# EAGLE design esp32-gps-eth-v10modules2 (EAGLE 7.3.0)
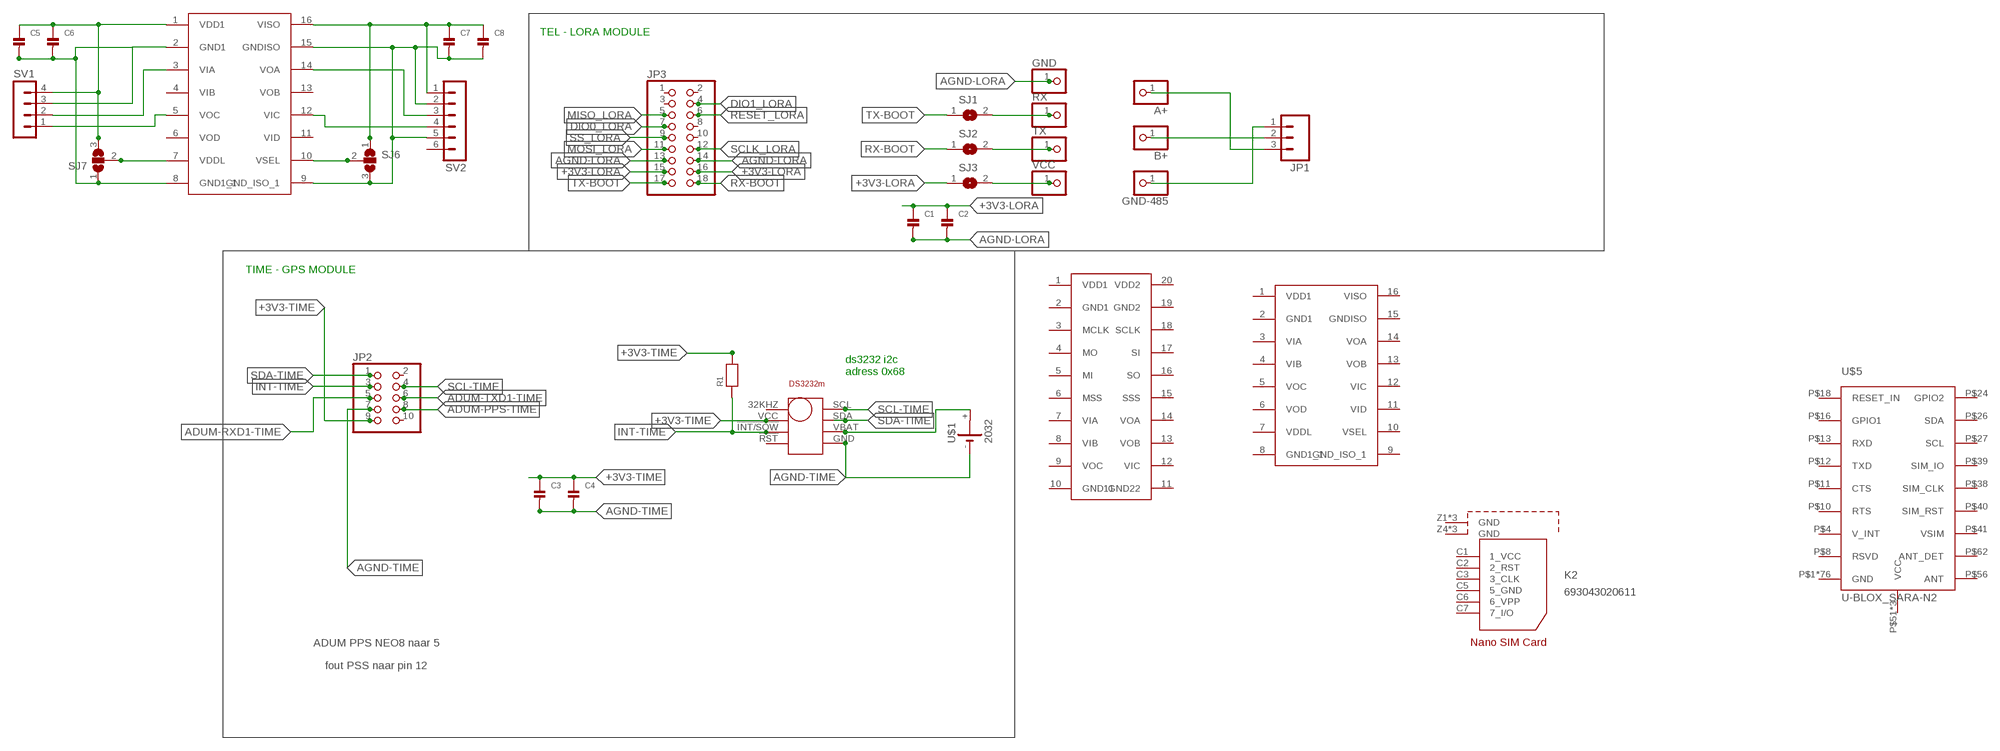
[diagram p0: schematic, sheet 1]

## Parts
A+  PINHD-1X1CB  [1X01-CLEANBIG]
ADUM4151  ADUM4151  [SOIC20R]
B+  PINHD-1X1CB  [1X01-CLEANBIG]
C1  CAP_CERAMIC0805  [0805]
C2  CAP_CERAMIC0805  [0805]
C3  CAP_CERAMIC0805  [0805]
C4  CAP_CERAMIC0805  [0805]
C5  CAP_CERAMIC0805  [0805]
C6  CAP_CERAMIC0805  [0805]
C7  CAP_CERAMIC0805  [0805]
C8  CAP_CERAMIC0805  [0805]
GND  PINHD-1X1CB  [1X01-CLEANBIG]
GND-485  PINHD-1X1CB  [1X01-CLEANBIG]
JP1  M03SCREW  [SCREWTERMINAL-3.5MM-3]
JP2  PINHD-2X5/90  [2X05/90]
JP3  PINHD-2X9/90  [2X09/90]
K2  693043020611  [693043020611]
R1  RESISTOR0805  [0805]
RX  PINHD-1X1CB  [1X01-CLEANBIG]
SJ1  SOLDERJUMPERREFLOW  [SOLDERJUMPER_REFLOW]
SJ2  SOLDERJUMPERREFLOW  [SOLDERJUMPER_REFLOW]
SJ3  SOLDERJUMPERREFLOW  [SOLDERJUMPER_REFLOW]
SJ6  SJ2W  [SJ_2]
SJ7  SJ2W  [SJ_2]
SV1  MA04-1  [MA04-1]
SV2  MA06-1  [MA06-1]
TX  PINHD-1X1CB  [1X01-CLEANBIG]
U$1  2032  [KZH20SMD]
U$2  ADUM6402  [SOIC16R]
U$3  ADUM6402  [SOIC16R]
U$4  DS3232M  [SOIC8]
U$5  U-BLOX_SARA-N2  [SARA-N2]
VCC  PINHD-1X1CB  [1X01-CLEANBIG]

## Nets
+3V3-LORA: C1.1 C2.1 JP3.15 JP3.16 SJ3.1
+3V3-TIME: C3.1 C4.1 JP2.9 R1.2 U$4.VCC
ADUM-PPS-TIME: JP2.8
ADUM-RXD1-TIME: JP2.5
ADUM-TXD1-TIME: JP2.6
AGND-LORA: C1.2 C2.2 GND.1 JP3.13 JP3.14
AGND-TIME: C3.2 C4.2 JP2.7 U$1.- U$4.GND
DIO0_LORA: JP3.7
DIO1_LORA: JP3.4
GND-PROG1: C5.2 C6.2 SJ7.1 U$3.8(GND1_1)
GND-PROG2: C7.2 C8.2 SJ6.3 SV2.2 SV2.5 U$3.9(GND_ISO_1) U$3.15(GNDISO)
INT-TIME: JP2.3 R1.1 U$4.!INT/!!SQW
MISO_LORA: JP3.5
MOSI_LORA: JP3.11
N$1: A+.1 JP1.3
N$2: B+.1 JP1.2
N$3: GND-485.1 JP1.1
N$4: RX.1 SJ1.2
N$6: U$1.+ U$4.VBAT
N$7: SJ2.2 TX.1
N$8: SJ3.2 VCC.1
N$147: SV1.1 U$3.5(VOC)
N$148: SV1.3 U$3.2(GND1)
N$149: SV1.2 U$3.3(VIA)
N$153: SV2.3 U$3.14(VOA)
N$154: SV2.4 U$3.12(VIC)
N$156: SJ7.2 U$3.7(VDDL)
N$157: SJ6.2 U$3.10(VSEL)
RESET_LORA: JP3.6
RX-BOOT: JP3.18 SJ2.1
SCL-TIME: JP2.4 U$4.SCL
SCLK_LORA: JP3.12
SDA-TIME: JP2.1 U$4.SDA
SS_LORA: JP3.9
TX-BOOT: JP3.17 SJ1.1
VCC2-PROG: C7.1 C8.1 SJ6.1 SV2.1 U$3.16(VISO)
VCC-PROG: C5.1 C6.1 SJ7.3 SV1.4 U$3.1(VDD1)
Unconnected: ADUM4151.1(VDD1) ADUM4151.2(GND1) ADUM4151.3(MCLK) ADUM4151.4(MO) ADUM4151.5(MI) ADUM4151.6(MSS) ADUM4151.7(VIA) ADUM4151.8(VIB) ADUM4151.9(VOC) ADUM4151.10(GND11) ADUM4151.11(GND22) ADUM4151.12(VIC) ADUM4151.13(VOB) ADUM4151.14(VOA) ADUM4151.15(SSS) ADUM4151.16(SO) ADUM4151.17(SI) ADUM4151.18(SCLK) ADUM4151.19(GND2) ADUM4151.20(VDD2) JP2.2 JP2.10 JP3.1 JP3.2 JP3.3 JP3.8 JP3.10 K2.C1(1_VCC) K2.C2(2_RST) K2.C3(3_CLK) K2.C5(5_GND) K2.C6(6_VPP) K2.C7(7_I/O) K2.Z1(GND) K2.Z2(GND) K2.Z3(GND) K2.Z4(GND) K2.Z5(GND) K2.Z6(GND) SV2.6 U$2.1(VDD1) U$2.2(GND1) U$2.3(VIA) U$2.4(VIB) U$2.5(VOC) U$2.6(VOD) U$2.7(VDDL) U$2.8(GND1_1) U$2.9(GND_ISO_1) U$2.10(VSEL) U$2.11(VID) U$2.12(VIC) U$2.13(VOB) U$2.14(VOA) U$2.15(GNDISO) U$2.16(VISO) U$3.4(VIB) U$3.6(VOD) U$3.11(VID) U$3.13(VOB) U$4.32KHZ U$4.!RST U$5.P$4(V_INT) U$5.P$8(RSVD) U$5.P$10(RTS) U$5.P$11(CTS) U$5.P$12(TXD) U$5.P$13(RXD) U$5.P$16(GPIO1) U$5.P$18(RESET_IN) U$5.P$24(GPIO2) U$5.P$26(SDA) U$5.P$27(SCL) U$5.P$38(SIM_CLK) U$5.P$39(SIM_IO) U$5.P$40(SIM_RST) U$5.P$41(VSIM) U$5.P$56(ANT) U$5.P$62(ANT_DET)

## Notes on the sheet
- TEL - LORA MODULE
- TIME - GPS MODULE
- ds3232 i2c
  adress 0x68
- ADUM PPS NEO8 naar 5
- fout PSS naar pin 12

## Power pins joined to a net without a drawn wire
GND: U$5.P$1(GND) U$5.P$2(GND) U$5.P$3(GND) U$5.P$5(GND) U$5.P$6(GND) U$5.P$7(GND) U$5.P$9(GND) U$5.P$14(GND) U$5.P$15(GND) U$5.P$17(GND) U$5.P$19(GND) U$5.P$20(GND) U$5.P$21(GND) U$5.P$22(GND) U$5.P$23(GND) U$5.P$25(GND) U$5.P$28(GND) U$5.P$29(GND) U$5.P$30(GND) U$5.P$31(GND) U$5.P$32(GND) U$5.P$33(GND) U$5.P$34(GND) U$5.P$35(GND) U$5.P$36(GND) U$5.P$37(GND) U$5.P$42(GND) U$5.P$43(GND) U$5.P$44(GND) U$5.P$45(GND) U$5.P$46(GND) U$5.P$47(GND) U$5.P$48(GND) U$5.P$49(GND) U$5.P$50(GND) U$5.P$54(GND) U$5.P$55(GND) U$5.P$57(GND) U$5.P$58(GND) U$5.P$59(GND) U$5.P$60(GND) U$5.P$61(GND) U$5.P$63(GND) U$5.P$64(GND) U$5.P$65(GND) U$5.P$66(GND) U$5.P$67(GND) U$5.P$68(GND) U$5.P$69(GND) U$5.P$70(GND) U$5.P$71(GND) U$5.P$72(GND) U$5.P$73(GND) U$5.P$74(GND) U$5.P$75(GND) U$5.P$76(GND) U$5.P$77(GND) U$5.P$78(GND) U$5.P$79(GND) U$5.P$80(GND) U$5.P$81(GND) U$5.P$82(GND) U$5.P$83(GND) U$5.P$84(GND) U$5.P$85(GND) U$5.P$86(GND) U$5.P$87(GND) U$5.P$88(GND) U$5.P$89(GND) U$5.P$90(GND) U$5.P$91(GND) U$5.P$92(GND) U$5.P$93(GND) U$5.P$94(GND) U$5.P$95(GND) U$5.P$96(GND)
VCC: U$5.P$51(VCC) U$5.P$52(VCC) U$5.P$53(VCC)

## Library data of the parts
A+ B+ GND GND-485 RX TX VCC = adafruit:PINHD-1X1: Pin header 1x1 for 0.1" spacing With round pins
ADUM4151 = Schematics:ADUM4151
C1-C8 = microbuilder:CAP_CERAMIC: Ceramic Capacitors 0402 - 0402 Surface Mount Capacitors 16pF 50V 5% [Digikey: 445-4899-2-ND] 18pF 50V 5% [Digikey: 490-1281-2-ND] 22pF 50V 5% [Digikey: 490-1283-2-ND] 68pF 50V 5% [Digikey: 490-1289-2-ND] 0.1uF 10V 10% [Digikey: 490-1318-2-ND] 1.0uF 6.3V 10% [Digikey: 490-1320-2-ND] 0603 - 0603 Surface Mount Capacitors 16 pF 50V 5% [Digikey: 445-5051-2-ND] 22 pF 50V [Digikey: PCC220ACVTR-ND] 33 pF 50V 5% [Digikey: 490-1415-1-ND] 56pF 50V 5% [Digikey: 490-1421-1-ND] 220pF 50V 5% [Digikey: 445-1285-1-ND] 680 pF 50V 2200 pF 50V 5% C0G [Digikey: 445-1297-1-ND] 5600 pF 100V 5% X7R [Digikey: 478-3711-1-ND] 0.1 µF 25V 10% [Digikey: PCC2277TR-ND] 0.22 µF 16V 10% X7R [Digikey: 445-1318-1-ND] 1.0 µF 25V 10% [Digikey: 445-5146-2-ND] 0603 - RF Specific 3pF 250V +/-0.1pF RF [Digikey: 712-1347-1-ND] 18 pF 250V 5% [Digikey: 478-3505-1-ND or 712-1322-1-ND] 56 pF 250V 5% C0G RF [Digikey: 490-4867-1-ND] 68 pF 250V RF [Digikey: 490-4868-1-ND] 0805 - 0805 Surface Mount Capacitors 220 pF 250V 2% RF Ceramic Capacitor [Digikey: 712-1398-1-ND] 1000 pF 50V 2% NP0 Ceramic Capacitor [Digikey: 478-3760-1-ND] 0.1 µF 25V 10% Ceramic Capacitor [Digikey: PCC1828TR-ND] 1.0 µF 16V 10% Ceramic Capacitor[Digikey: 490-1691-2-ND] 10.0 µF 10V 10% Ceramic Capacitor[Digikey: 709-1228-1-ND] 10.0 uF 16V 10% Ceramic Capacitor [Digikey: 478-5165-2-ND] 47 uF 6.3V 20% Ceramic Capacitor [Digikey: 587-1779-1-ND or 399-5506-1-ND] 1206 - 1206 Surface Mount Capacitors 47uF 10V 20% Ceramic Capacitor [Digikey: 490-5528-1-ND or 399-5508-1-ND or 445-6010-1-ND] 100uF 6.3V -20%, +80% Y5V Ceramic Capacitor (Digikey: 490-4512-1-ND, Mouser: 81-GRM31CF50J107ZE1L)
JP1 = SparkFun:M03: Header 3 Standard 3-pin 0.1" header. Use with straight break away headers (SKU : PRT-00116), right angle break away headers (PRT-00553), swiss pins (PRT-00743), machine pins (PRT-00117), and female headers (PRT-00115). Molex polarized connector foot print use with SKU : PRT-08232 with associated crimp pins and housings.
JP2 = pinhead:PINHD-2X5: PIN HEADER
JP3 = pinhead:PINHD-2X9: PIN HEADER
K2 = Wurth_Elektronik_Electromechanic_Input-Output_Connectors_rev15c:693043020611: WR-CRD_Nano SIM_Push & Pull_SMT Nano SIM Push & Pull Type SMT - 1.20mm Height - T&R with Mylar for Pick & Place Code:Con_I-O_COM_CRD_SIM_Nano_693043020611_693043020611 <http://katalog.we-online.de/media/images/eican/Con_I-O_COM_CRD_SIM_Nano_693043020611_pf2.jpg> Details see: http://katalog.we-online.de/en/em/693_043_020_611/693_043_020_611?m Created 2014-12-22, aslant tao 2014 (C) Würth Elektronik
R1 = microbuilder:RESISTOR: Resistors 0402 - 0402 Surface Mount Package 22 Ohm 1% 1/16W [Digikey: 311-22.0LRTR-ND] 33 Ohm 5% 1/16W 1.0K 5% 1/16W 1.5K 5% 1/16W 2.0K 1% 1/16W 10.0K 1% 1/16W [Digikey: 311-10.0KLRTR-ND] 10.0K 5% 1/16W [Digikey: RMCF0402JT10K0TR-ND] 12.1K 1% 1/16W [Digikey: 311-22.0LRTR-ND] 100.0K 5% 1/16W 0603 - 0603 Surface Mount Package 0 Ohm 1/10 Watt 1% Resistor 15 Ohm 1/10 Watt 1% Resistor 33 Ohm 1/10 Watt 1% Resistor 49.9 Ohm 1/10 Watt 1% Resistor 100 Ohm 1/10 Watt 1% Resistor 150 Ohm 1/10 Watt 1% Resistor 240 Ohm 1/10 Watt 1% Resistor 390 Ohm 1/10 Watt 1% Resistor 560 Ohm 1/10 Watt 1% Resistor 680 Ohm 1/10 Watt 1% Resistor 750 Ohm 1/10 Watt 1% Resistor 1.0K Ohm 1/10 Watt 1% Resistor 1.5K Ohm 1/10 Watt 1% Resistor 2.0K Ohm 1/10 Watt 1% Resistor 2.2K Ohm 1/10 Watt 1% Resistor 3.3K Ohm 1/10 Watt 1% Resistor 4.7K Ohm 1/10 Watt 1% Resistor 10.0K Ohm 1/10 Watt 1% Resistor 12.0K Ohm 1/10 Watt 1% Resistor 12.1K Ohm 1/10 Watt 1% Resistor 20.0K Ohm 1/10 Watt 1% Resistor 33.0K Ohm 1/10 Watt 1% Resistor 100.0K Ohm 1/10 Watt 1% Resistor 0805 - 0805 Surface Mount Package 0 Ohm 1/8 Watt 1% Resistor 33 Ohm 1/8 Watt 1% Resistor 100 Ohm 1/8 Watt 1% Resistor 150 Ohm 1/8 Watt 1% Resistor 200 Ohm 1/8 Watt 1% Resistor 240 Ohm 1/8 Watt 1% Resistor 330 Ohm 1/8 Watt 1% Resistor 390 Ohm 1/8 Watt 1% Resistor 470 Ohm 1/8 Watt 1% Resistor 1.0K Ohm 1/8 Watt 1% Resistor 1.5K Ohm 1/8 Watt 1% Resistor 2.0K Ohm 1/8 Watt 1% Resistor 4.7K Ohm 1/8 Watt 1% Resistor 5.1K Ohm 1/8 Watt 1% Resistor 5.6K Ohm 1/8 Watt 1% Resistor 10.0K Ohm 1/8 Watt 1% Resistor 22.0K Ohm 1/8 Watt 1% Resistor 33.0K Ohm 1/8 Watt 1% Resistor 100K Ohm 1/8 Watt 1% Resistor 1206 - 1206 Surface Mount Package 2012 - 2010 Surface Mount Package 0.11 Ohm 1/2 Watt 1% Resistor - Digikey: RHM.11UCT-ND
SJ1-SJ3 = microbuilder:SOLDERJUMPER: SMD Solder JUMPER Solder the two pads together to create a connection, or remove the solder to break it. REFLOW - Use this footprint for solder paste and reflow ovens. WAVE - Use this footprint for hand-soldering (larger pads). CLOSED - Has a trace between the two pads to ensure it is closed by default. The trace needs to be cut to disable the jumper, and can be closed again by creating a solder bridge between the two pads.
SJ6 SJ7 = jumper:SJ2W: SMD solder JUMPER
SV1 = con-lstb:MA04-1: PIN HEADER; OC_FARNELL: unknown; OC_NEWARK: unknown
SV2 = con-lstb:MA06-1: PIN HEADER; OC_FARNELL: unknown; OC_NEWARK: unknown
U$1 = kzh20_lithium_batterie_holder:2032
U$2 U$3 = ADUM6402:ADUM6402
U$4 = DS3232M:DS3232M
U$5 = UBLOX_SARA-N2:U-BLOX_SARA-N2

## Board
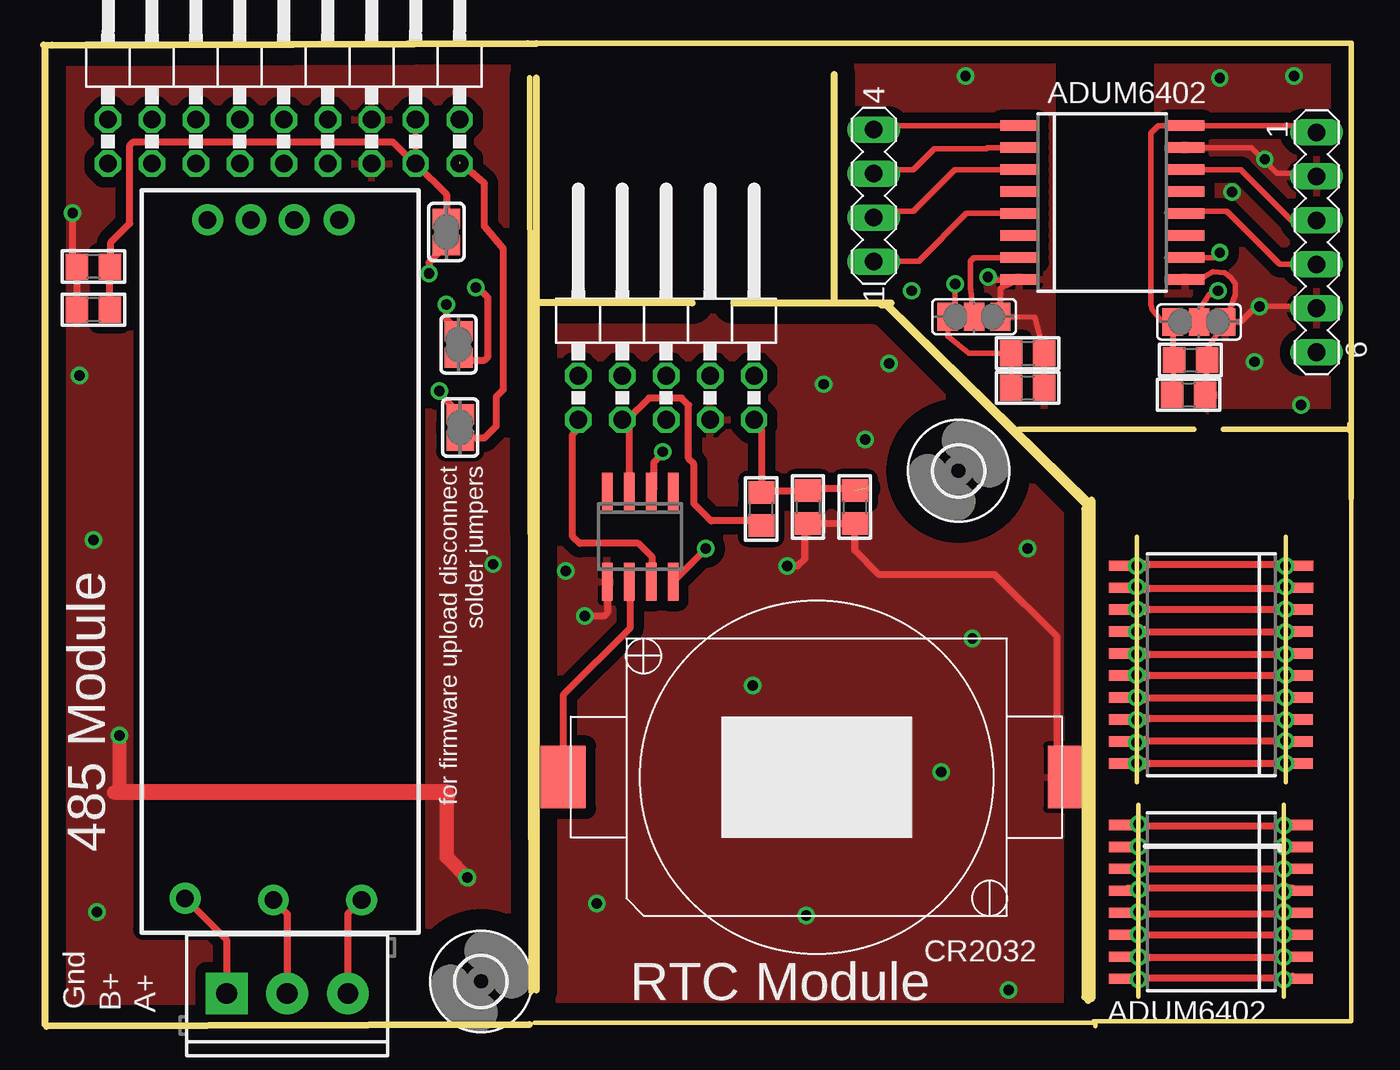
[diagram p1: board, top side]
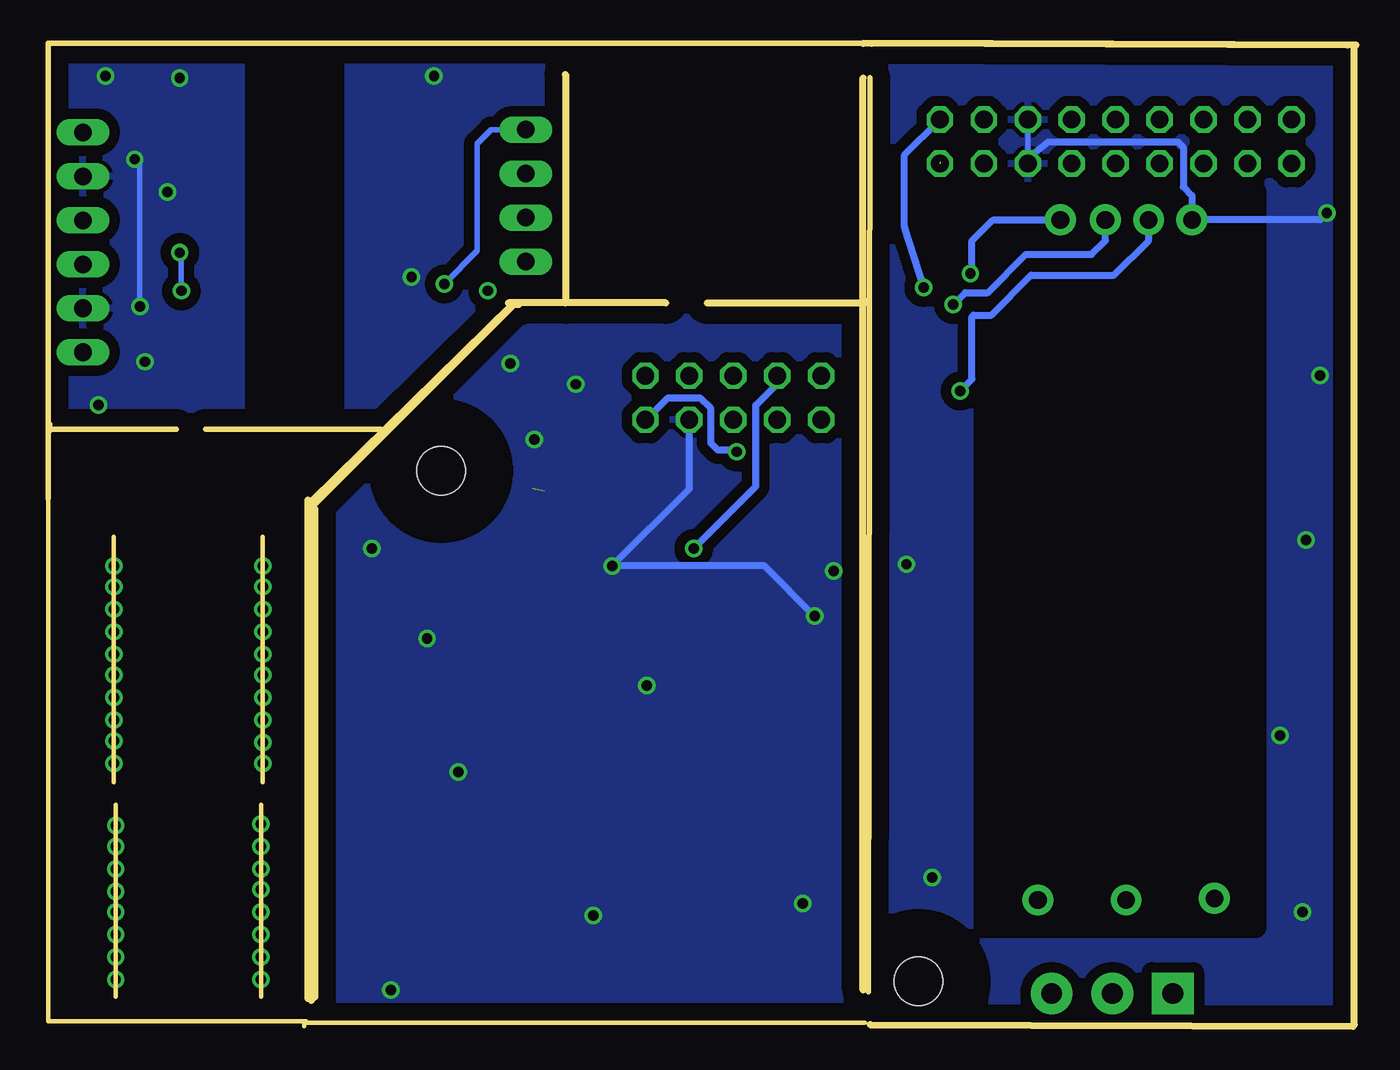
[diagram p2: board, bottom side, seen from below]

Size 75.6 x 56.8 mm. Coordinates in mm from the lower left corner, seen from the top.
Outline: 28.1,0.1 0.2,0 0.1,0.1 0.1,56.6
Outline: 60.6,30.4 60.6,1.6
Outline: 39.9,41.8 45.7,41.8
Outline: 28.5,2.1 28.5,54.8
Outline: 0,56.7 28,56.8
Outline: 0.5,56.7 28.5,56.8
Outline: 48.8,41.7 60.4,30.3
Outline: 28.4,0.2 60.7,0.2
Outline: 60.7,0.2 60.8,0.2 60.8,0
Outline: 63.2,14.1 63.2,28.3
Outline: 71.8,28.3 71.8,14.1
Outline: 71.7,1.7 71.7,12.8
Outline: 63.3,12.8 63.3,1.7
Outline: 75.6,30.4 75.6,0.3 60.7,0.3 60.7,0.2
Outline: 28.4,56.8 75.6,56.8 75.6,34.5
Outline: 75.6,34.5 75.6,30.5
Outline: 75.5,34.4 75.5,34.8
Outline: 45.7,55 45.7,41.8
Outline: 45.7,41.8 49,41.8
Outline: 37.5,41.8 28.4,41.8 28.3,41.9
Outline: 48.4,41.7 48.7,41.7 60.4,30
Outline: 60.2,29.9 60.2,1.7 60.4,1.5
Outline: 56.4,34.5 66.5,34.5
Outline: 68.2,34.5 75.6,34.5
Outline: 28.1,54.8 28.2,2
Copper layers (1*16): Top 0.035mm / dielectric 1.5mm / Bottom 0.035mm
Design rules "default *": minimum track width 5mil, minimum drill 24mil, track to track 5mil, track to pad 8mil, pad to pad 8mil, via to via 8mil, smd to smd 8mil, copper to edge 40mil, drill to drill 8mil, minimum pad ring 10mil, minimum via ring 8mil, stop-mask expansion 4mil, vias tented up to drill 0mil, thermal gap 10mil
tKeepout: area 59.1,34.3 to 63.6,56.9
bKeepout: area 59.1,34.4 to 63.6,57
tRestrict: area 59.1,34.5 to 63.6,57; area 5.8,5.6 to 21.5,48.2
bRestrict: area 59.1,34.5 to 63.6,57; area 5.8,5.7 to 21.5,48.2

### Footprints (pad centres in the part's own frame; a part is rotated, then mirrored left to right if it is on the bottom)
1X01-CLEANBIG = drill 1.016 pad 1.778: 1 0,0
SOIC20R = smd 0.6 x 2.2: 1 -5.715,-4.775; 2 -4.445,-4.775; 3 -3.175,-4.775; 4 -1.905,-4.775; 5 -0.635,-4.775; 6 0.635,-4.775; 7 1.905,-4.775; 8 3.175,-4.775; 9 4.445,-4.8; 10 5.715,-4.8; 11 5.715,4.8; 12 4.445,4.8; 13 3.175,4.8; 14 1.905,4.8; 15 0.635,4.8; 16 -0.635,4.8; 17 -1.905,4.8; 18 -3.175,4.8; 19 -4.445,4.8; 20 -5.715,4.8
0805 = smd 1.3 x 1.5: 1 -0.95,0; 2 0.95,0
SCREWTERMINAL-3.5MM-3 = drill 1.2 pad 2.413 square: 1 0,0 | drill 1.2 pad 2.413: 2 3.5,0; 3 7,0
2X05/90 = drill 1.016 octagon: 1 -5.08,-6.35; 2 -5.08,-3.81; 3 -2.54,-6.35; 4 -2.54,-3.81; 5 0,-6.35; 6 0,-3.81; 7 2.54,-6.35; 8 2.54,-3.81; 9 5.08,-6.35; 10 5.08,-3.81
2X09/90 = drill 1.016 octagon: 1 -10.16,-6.35; 2 -10.16,-3.81; 3 -7.62,-6.35; 4 -7.62,-3.81; 5 -5.08,-6.35; 6 -5.08,-3.81; 7 -2.54,-6.35; 8 -2.54,-3.81; 9 0,-6.35; 10 0,-3.81; 11 2.54,-6.35; 12 2.54,-3.81; 13 5.08,-6.35; 14 5.08,-3.81; 15 7.62,-6.35; 16 7.62,-3.81; 17 10.16,-6.35; 18 10.16,-3.81
693043020611 = smd 0.65 x 1.3: C1 -1.9,0; C2 0.64,0; C3 1.91,0; C5 -3.17,0; C6 -0.63,0; C7 3.18,0 | smd 0.9 x 1: Z1 4.4,-12.14; Z6 -4.4,-12.14 | smd 0.35 x 1.8: Z2 4.595,-6.42; Z3 4.595,-0.67; Z4 -4.596,-0.67; Z5 -4.596,-6.42
SOLDERJUMPER_REFLOW = smd 1.168 x 1.6: 1 -0.762,0; 2 0.762,0
SJ_2 = smd 1.168 x 1.6: 1 -1.524,0; 2 0,0; 3 1.524,0
MA04-1 = drill 1.016 long: 1 -3.81,0; 2 -1.27,0; 3 1.27,0; 4 3.81,0
MA06-1 = drill 1.016 long: 1 -6.35,0; 2 -3.81,0; 3 -1.27,0; 4 1.27,0; 5 3.81,0; 6 6.35,0
KZH20SMD = smd 2.6 x 3.6: + 14.65,0; - -14.65,0
SOIC16R = smd 0.6 x 2.2: 1 -4.445,-4.775; 2 -3.175,-4.775; 3 -1.905,-4.775; 4 -0.635,-4.775; 5 0.635,-4.775; 6 1.905,-4.775; 7 3.175,-4.775; 8 4.445,-4.775; 9 4.445,4.8; 10 3.175,4.8; 11 1.905,4.8; 12 0.635,4.8; 13 -0.635,4.8; 14 -1.905,4.8; 15 -3.175,4.8; 16 -4.445,4.8
SOIC8 = smd 0.6 x 2.2: 32KHZ -1.905,-2.6; !INT/!!SQW 0.635,-2.6; !RST 1.905,-2.6; GND 1.905,2.6; SCL -1.905,2.6; SDA -0.635,2.6; VBAT 0.635,2.6; VCC -0.635,-2.6
SARA-N2 = smd 1.5 x 0.8: P$1 1.05,2; P$2 1.05,3.1; P$3 1.05,4.2; P$4 1.05,5.3; P$5 1.05,6.4; P$6 1.05,7.5; P$7 1.05,8.6; P$8 1.05,9.7; P$9 1.05,10.8; P$10 1.05,11.9; P$11 1.05,13; P$12 1.05,14.1; P$13 1.05,15.2; P$14 1.05,16.3; P$15 1.05,17.4; P$16 1.05,18.5; P$17 1.05,19.6; P$18 1.05,20.7; P$19 1.05,21.8; P$20 1.05,22.9; P$21 1.05,24; P$22 14.95,2; P$23 14.95,3.1; P$24 14.95,4.2; P$25 14.95,5.3; P$26 14.95,6.4; P$27 14.95,7.5; P$28 14.95,8.6; P$29 14.95,9.7; P$30 14.95,10.8; P$31 14.95,11.9; P$32 14.95,13; P$33 14.95,14.1; P$34 14.95,15.2; P$35 14.95,16.3; P$36 14.95,17.4; P$37 14.95,18.5; P$38 14.95,19.6; P$39 14.95,20.7; P$40 14.95,21.8; P$41 14.95,22.9; P$42 14.95,24 | smd 0.8 x 1.5: P$43 3.6,24.95; P$44 4.7,24.95; P$45 5.8,24.95; P$46 6.9,24.95; P$47 8,24.95; P$48 9.1,24.95; P$49 10.2,24.95; P$50 11.3,24.95; P$51 12.4,24.95; P$52 13.5,24.95; P$53 2.5,24.95; P$54 2.5,1.05; P$55 3.6,1.05; P$56 4.7,1.05; P$57 5.8,1.05; P$58 6.9,1.05; P$59 8,1.05; P$60 9.1,1.05; P$61 10.2,1.05; P$62 11.3,1.05; P$63 12.4,1.05; P$64 13.5,1.05 | smd 1.1 x 1.1: P$65 2.75,23.25; P$66 4.85,23.25; P$67 6.95,23.25; P$68 9.05,23.25; P$69 11.15,23.25; P$70 13.25,23.25; P$71 2.75,21.45; P$72 4.85,21.45; P$73 6.95,21.45; P$74 9.05,21.45; P$75 11.15,21.45; P$76 13.25,21.45; P$77 2.75,19.65; P$78 13.25,19.65; P$79 2.75,16.05; P$80 13.25,16.05; P$81 13.25,2.75; P$82 11.15,2.75; P$83 9.05,2.75; P$84 6.95,2.75; P$85 4.85,2.75; P$86 2.75,2.75; P$87 13.25,4.55; P$88 11.15,4.55; P$89 9.05,4.55; P$90 6.95,4.55; P$91 4.85,4.55; P$92 2.75,4.55; P$93 13.25,6.35; P$94 2.75,6.35; P$95 13.25,9.95; P$96 2.75,9.95
2,8 = hole 2.8: 0,0

### Placement (x,y rotation side)
A+  18.4,7.3 0 top
ADUM4151  67.5,20.9 90 top
B+  13.3,7.3 0 top
C1  2.9,43.9 180 top
C2  2.9,41.4 180 top
C3  44.2,30 270 top
C4  46.9,30 270 top
C5  56.9,36.9 0 top
C6  56.9,38.9 0 top
C7  66.2,36.5 0 top
C8  66.3,38.5 0 top
GND  9.5,46.6 0 top
GND-485  8.2,7.4 0 top
JP1  10.6,1.9 0 top
JP2  36,41.4 0 top
JP3  13.9,56.2 0 top
K2  83.4,38.7 90 top  (outside the outline)
R1  41.5,29.9 90 top
RX  12,46.6 0 top
SJ1  24.1,34.6 90 top
SJ2  24,39.4 90 top
SJ3  23.3,45.9 270 top
SJ6  66.8,40.7 0 top
SJ7  53.8,41 180 top
SV1  48,48 90 top
SV2  73.6,45.3 270 top
TX  14.5,46.6 0 top
U$1  44.7,14.4 180 top
U$2  67.5,7.2 90 top
U$3  61.2,47.6 270 top
U$4  34.5,28.3 180 top
U$5  81.4,2.4 0 top  (outside the outline)
U$7  [2,8]  25.3,2.6 0 top
U$8  [2,8]  52.9,32.1 0 top
VCC  17.1,46.6 0 top

### Tracks (layer width: path | path; a pad name or v marks a point on that pad's centre or on a via)
+3V3-LORA
  Top 0.305: JP3.16 JP3.15
  Top 0.406: SJ3.1 23.3,48.07 JP3.15 21.45,49.85 20.2,51.1 5.2,51.1 5,50.9 5,46.4 3.9,45.3 3.9,43.95 C1.1 C2.1
+3V3-TIME  (via drill 0.6)  (1 unrouted)
  Top 0.406: 47.6,31.1 44.35,31.1 C3.1 41.6,30.95 R1.2 41.5,34.5 41.3,34.7 41.3,34.83 JP2.9 | U$4.VCC 35.3,31.06 35.3,32.6 35.8,33.1 v35.8,33.2
  Bottom 0.406: v35.8,33.2 35.9,33.3 36.9,33.3 37.3,33.7 37.3,35.7 37.9,36.3 39.8,36.3 41.05,35.05 JP2.9
AGND-LORA  (via drill 0.6)
  Top 0.406: C2.2 C1.2 1.7,44.15 v1.7,47
  Top 0.813: 4.1,13.5 23.2,13.5 23.4,13.3 | v4.4,16.8 4.4,13.7 4.3,13.6 23.3,13.6 23.3,9.8 v24.5,8.6 24.6,8.5 24.6,8.6
  Bottom 0.305: JP3.14 JP3.13
  Bottom 0.406: JP3.13 19,50.13 17.8,51.1 10.3,51.1 10,50.8 10,48.5 9.5,48 GND.1 2.1,46.6 v1.7,47
  other vias: 2.1,37.6 2.9,28.1 3.1,6.6 26,26.7
  pour Top (isolate 0.61): 0.4,56.2 0.4,0.5 27.6,0.5 27.7,0.4 27.7,56.2 0.5,56.2
  pour Bottom (isolate 0.61): 0.4,55.9 0.3,0.6 0.4,0.5 27.8,0.5 27.9,0.6 27.9,56.3 1.1,56.4 0.5,56.3
AGND-TIME  (via drill 0.6)
  Top 0.406: U$1.- 59.25,14.3 58.9,14.3 59,14.4 59,15.3 58.6,15.7 58.6,22.5 55,26.1 48.3,26.1 46.9,27.5 C4.2 C3.2 44,28.85 44,27 43.6,26.6 v43,26.6 | U$4.GND 32.6,23.9 32.4,23.7 v31.3,23.7
  Bottom 0.406: JP2.7 38.54,31.06 v43,26.6 34.2,26.6 v31.3,23.7
  other vias: 45.1,37.1 48.9,38.3 47.5,33.9 56.9,27.6 53.7,22.4 41,19.7 32,7.1 44.1,6.4 55.8,2.1 51.9,14.7 30.2,26.3
  pour Bottom (isolate 0.61): 28.9,41.5 48.3,41.5 59.9,29.9 59.9,0.8 29,0.8 28.9,0.7 28.9,41.3 29,41.4
  pour Top (isolate 0.61): 28.8,41.5 48.4,41.5 59.9,30 59.9,0.7 28.9,0.7 28.9,41.3
GND  (75 unrouted)
GND-PROG1  (via drill 0.6)
  Top 0.305: C5.2 C6.2 57.32,40.97 SJ7.1 55.32,42.66 U$3.8 | 56.3,43.1 54.8,43.1 v54.6,43.3
  other vias: 53.3,54.9
  pour Bottom (isolate 0.61): 45.9,56.6 45.9,42.3 46.1,42.1 48.9,42.1 49,42.1 56.3,34.8 58.8,34.8 58.9,34.9 58.9,56.2 59.2,56.5 46.2,56.5 46,56.7
  pour Top (isolate 0.61): 45.9,56.6 58.7,56.6 58.9,56.4 58.9,35 58.8,34.9 56.8,34.9 56.5,34.6 56.4,34.6 49,42 46.1,42 46,42.1 46,56.5
GND-PROG2  (via drill 0.6)
  Top 0.305: SV2.2 73.41,49.3 71.3,49.3 70.6,50 | 70.6,50 69.83,50.77 U$3.15 | C7.2 C8.2 67.22,39.07 SJ6.3 | SJ6.3 68.9,42.28 68.9,42.9 68.64,43.26 68.3,43.55 67.6,43.6 66.9,43.2 66.1,43.1 U$3.9 | SV2.5 73.49,41.6 v70.3,41.6 70.1,41.6 69.2,40.7 SJ6.3 | 70.6,50 v70.6,50.1
  Bottom 0.305: v70.6,50.1 70.3,49.8 v70.3,41.6
  other vias: 70,38.4 68,54.8 72.3,54.9 72.7,35.9 68.7,48.2
  pour Bottom (isolate 0.61): 63.7,56.5 75.4,56.5 75.4,34.8 75.5,34.7 63.7,34.7 63.7,56.4
  pour Top (isolate 0.61): 63.8,56.6 75.3,56.6 75.4,56.5 75.4,34.8 75.5,34.7 63.7,34.7 63.7,56.5
INT-TIME
  Top 0.406: U$4.!INT/!!SQW 33.87,34.65 JP2.3 33.75,35.05 35,36.3 36.9,36.3 37.3,35.9 37.3,32.8 37.6,32.5 37.6,30.2 38.6,29.2 41.25,29.2 R1.1
N$1
  Top 0.406: A+.1 17.6,6.5 JP1.3
N$2
  Top 0.406: B+.1 14.1,6.5 JP1.2
N$3
  Top 0.406: GND-485.1 10.6,5 JP1.1
N$4  (via drill 0.6)
  Top 0.406: SJ1.2 22.9,36.56 v22.9,36.7
  Bottom 0.406: v22.9,36.7 22.2,37.4 22.2,41 22.1,41.1 21.1,41.1 18.8,43.4 14,43.4 12,45.4 RX.1
N$5  (via drill 0.6)
  other vias: 63.3,2.7
N$6
  Top 0.406: U$4.VBAT 33.9,25.66 33.9,23 30.05,19.15 U$1.+
N$7  (via drill 0.6)
  Top 0.406: SJ2.2 23.3,40.86 v23.3,41.7
  Bottom 0.406: v23.3,41.7 22.6,42.4 21.3,42.4 19.1,44.6 15.3,44.6 14.5,45.4 TX.1
N$8  (via drill 0.6)
  Top 0.406: SJ3.2 22.3,44.14 v22.3,43.5
  Bottom 0.406: v22.3,43.5 22.2,43.6 22.2,45.4 21,46.6 VCC.1
N$9  (via drill 0.6)
  Top 0.406: v63.3,4 72.4,4 72.5,4.1
N$10  (via drill 0.6)
  Top 0.406: v63.3,5.3 72.2,5.3 72.3,5.4
N$11  (via drill 0.6)
  other vias: 63.3,6.6
N$12  (via drill 0.6)
  other vias: 63.3,7.9
N$13  (via drill 0.6)
  Top 0.406: v63.3,9.1 72.2,9.1 72.3,9.2
N$14  (via drill 0.6)
  other vias: 63.3,10.4
N$15  (via drill 0.6)
  other vias: 63.3,11.7
N$16  (via drill 0.6)
  other vias: 71.7,2.7
N$17  (via drill 0.6)
  other vias: 71.7,4
N$18  (via drill 0.6)
  other vias: 71.7,5.3
N$19  (via drill 0.6)
  other vias: 71.7,6.6
N$20  (via drill 0.6)
  other vias: 71.7,7.8
N$21  (via drill 0.6)
  other vias: 71.7,9.1
N$25  (via drill 0.6)
  other vias: 71.7,10.4
N$26  (via drill 0.6)
  other vias: 71.7,11.6
N$27  (via drill 0.6)
  other vias: 63.2,15.2
N$28  (via drill 0.6)
  other vias: 63.2,16.4
N$29  (via drill 0.6)
  other vias: 63.2,17.7
N$30  (via drill 0.6)
  other vias: 63.2,19
N$31  (via drill 0.6)
  Top 0.406: v63.2,20.3 72.5,20.3
N$32  (via drill 0.6)
  other vias: 63.2,21.5
N$33  (via drill 0.6)
  Top 0.406: v63.2,22.8 72.3,22.8
N$34  (via drill 0.6)
  other vias: 63.2,24.1
N$35  (via drill 0.6)
  other vias: 71.8,15.2
N$38  (via drill 0.6)
  Top 0.406: 62.6,16.5 v71.8,16.5
N$39  (via drill 0.6)
  other vias: 71.8,17.7
N$40  (via drill 0.6)
  other vias: 71.8,19
N$41  (via drill 0.6)
  other vias: 71.8,20.3
N$42  (via drill 0.6)
  other vias: 71.8,21.5
N$43  (via drill 0.6)
  other vias: 71.8,22.8
N$45  (via drill 0.6)
  other vias: 71.8,24.1
N$46
  Top 0.406: 62.9,15.2 72.2,15.2 72.3,15.3
N$47
  Top 0.406: 62.6,17.8 72.5,17.8
N$49
  Top 0.406: 62.7,19 72.4,19 72.5,19.1
N$51
  Top 0.406: 62.6,21.5 72.4,21.5 72.5,21.6
N$89
  Top 0.406: 62.6,24.1 72.5,24.1
N$90
  Top 0.406: 62.7,2.8 72.1,2.8 72.2,2.9
N$135
  Top 0.406: 62.7,6.5 72.2,6.5
N$136
  Top 0.406: 62.7,8 72.2,8 72.3,7.9
N$137
  Top 0.406: 62.7,11.6 72.4,11.6 72.5,11.7
N$138
  Top 0.406: 62.8,26.7 72.6,26.7
N$139
  Top 0.406: 62.7,25.3 72.6,25.3
N$140  (via drill 0.6)
  other vias: 63.2,25.4
N$142  (via drill 0.6)
  other vias: 63.2,26.6
N$145  (via drill 0.6)
  other vias: 71.8,25.4
N$146  (via drill 0.6)
  other vias: 71.8,26.6
N$147
  Top 0.305: SV1.1 50.6,44.2 53.36,46.97 U$3.5
N$148
  Top 0.305: SV1.3 48.23,49.5 50.3,49.5 51.5,50.7 54.5,50.7 54.58,50.77 U$3.2
N$149
  Top 0.305: SV1.2 48.37,47.1 50.3,47.1 52.7,49.5 54.7,49.5 54.7,49.51 U$3.3
N$153
  Top 0.305: U$3.14 65,49.6 65.2,49.6 65.3,49.5 69.2,49.5 72.13,46.57 SV2.3
N$154
  Top 0.305: U$3.12 64.94,47 65.6,47 65.7,47.1 68.4,47.1 71.47,44.03 SV2.4
N$155  (via drill 0.6)
  other vias: 50.2,42.5
N$156
  Top 0.305: U$3.7 55.3,44.4 53.8,44.4 53.6,44.2 53.6,42.7 SJ7.2
N$157  (via drill 0.6)
  Top 0.305: U$3.10 64.92,44.4 67.6,44.4 v68,44.7 | v67.9,42.5 67.8,42.3 67.4,42.3 66.6,41.1 SJ6.2
  Bottom 0.305: v68,44.7 67.9,44.6 v67.9,42.5
RX-BOOT  (via drill 0.6)
  Top 0.406: SJ2.1 24.04,38.6 24.1,38.6 24.2,38.5 25.5,38.5 25.7,38.7 25.7,42.1 25.1,42.7 v25,42.7
  Bottom 0.406: v25,42.7 26.1,46.2 26.1,50.35 JP3.18
SCL-TIME  (via drill 0.6)
  Top 0.406: U$4.SCL v38.3,27.59 v38.3,27.6
  Bottom 0.406: v38.3,27.6 34.7,31.2 34.7,35.9 33.46,37.14 JP2.4
SDA-TIME
  Top 0.406: U$4.SDA 35.2,25.77 35.2,27.1 34.4,27.9 31,27.9 30.6,28.3 30.6,34.2 30.92,34.52 JP2.1
TX-BOOT  (1 unrouted)
  Top 0.406: SJ1.1 24.26,34 25.5,34 26.2,34.7 26.2,36.4 26.6,36.8 26.6,44.9 25.5,46.2 25.5,48.7 24.05,49.95
VCC  (2 unrouted)
VCC2-PROG
  Top 0.305: SV2.1 73.2,52.05 U$3.16 64.44,52.05 64,51.6 64,41.7 64.1,41.4 64.6,40.8 65.3,40.5 65.3,37.65 C7.1 C8.1 65.28,39.27 SJ6.1
VCC-PROG  (via drill 0.6)
  Top 0.254: SV1.4 48.23,52.05
  Top 0.305: 48.23,52.05 U$3.1 | C5.1 C6.1 53.5,38.9 52.28,39.87 SJ7.3 52.5,40.9 52.7,41.3 v52.7,42.9
  Bottom 0.305: v52.7,42.9 50.8,44.8 50.8,51 49.99,51.81 SV1.4

### Text on the board
tNames: for firmware upload disconnect / solder jumpers | 485 Module | CR2032 | Gnd | B+ | A+ | RTC Module